# Altium schematic sheet record2.SchDoc
size A4
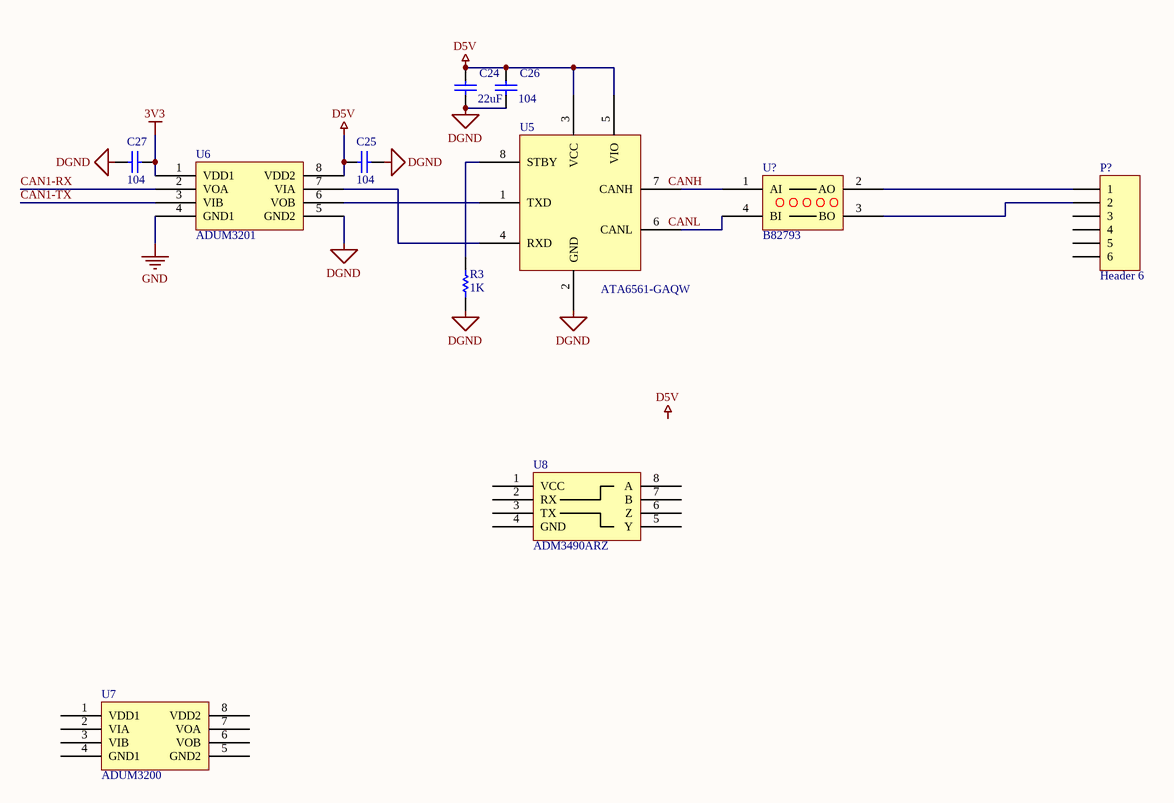
[diagram p0: record2.SchDoc]

## Parts
C24  22uf  [0603C]
C25  104  [0603C]
C26  104  [0603C]
C27  104  [0603C]
P?  Header 6
R3  R1K  [0603R]  (value not drawn)
U5  ATA6561-GAQW
U6  ADUM3201
U7  ADUM3200
U8  ADM3490ARZ
U?  B82793

## Nets
3V3: C27.1 U6.1(VDD1)
D5V: C24.2 C25.2 C26.2 U5.3(VCC) U5.5(VIO) U6.8(VDD2)
DGND: C24.1 C25.1 C26.1 C27.2 R3.1 U5.2(GND) U6.5(GND2)
GND: U6.4(GND1)
CAN1-RX: U6.2(VOA)
CAN1-TX: U6.3(VIB)
NetP?_1: P?.1 U?.2(AO)
NetP?_2: P?.2 U?.3(BO)
NetR3_2: R3.2 U5.8(STBY)
NetU5_1: U5.1(TXD) U6.6(VOB)
NetU5_4: U5.4(RXD) U6.7(VIA)
NetU5_6: U5.6(CANL) U?.4(BI)
NetU5_7: U5.7(CANH) U?.1(AI)

Not connected (* = marked no-connect by the designer): P? 3 4 5 6; U7 1(VDD1) 2(VIA) 3(VIB) 4(GND1) 5(GND2) 6(VOB) 7(VOA) 8(VDD2); U8 1(VCC) 2(RX) 3(TX) 4(GND) 5(Y) 6(Z) 7(B) 8(A)

## Notes on the sheet
- Labels drawn without touching a wire or pin: CANH, CANL, D5V
- (in symbol C0.1uF) 22uF
- (in symbol R10K) 1K

## Library data of the parts
C24-C27 = C0.1uF
P? = Header 6: Header, 6-Pin; LatestRevisionDate: 17-Jul-2002; LatestRevisionNote: Re-released for DXP Platform.; Publisher: Altium Limited
R3 = R10K